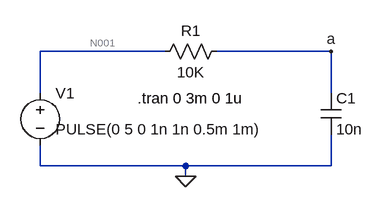
[diagram p0: schematic Pracitca3.asc]
Pracitca3.asc, the LTspice schematic file:
Version 4
SHEET 1 1204 680
WIRE 176 -848 -16 -848
WIRE 432 -848 256 -848
WIRE -16 -784 -16 -848
WIRE 432 -784 432 -848
WIRE -16 -672 -16 -704
WIRE 208 -672 -16 -672
WIRE 432 -672 432 -720
WIRE 432 -672 208 -672
WIRE 208 -656 208 -672
FLAG 208 -656 0
FLAG 432 -848 a
SYMBOL res 160 -832 R270
WINDOW 0 32 56 VTop 2
WINDOW 3 0 56 VBottom 2
SYMATTR InstName R1
SYMATTR Value 10K
SYMBOL cap 416 -784 R0
SYMATTR InstName C1
SYMATTR Value 10n
SYMBOL voltage -16 -800 R0
WINDOW 123 24 44 Left 2
WINDOW 39 0 0 Left 0
WINDOW 3 24 72 Left 2
SYMATTR InstName V1
SYMATTR Value PULSE(0 5 0 1n 1n 0.5m 1m)
TEXT 134 -776 Left 2 !.tran 0 3m 0 1u

The netlist it stands for:
* Pracitca3.asc
R1 N001 a 10K
C1 a 0 10n
V1 N001 0 PULSE(0 5 0 1n 1n 0.5m 1m)
.tran 0 3m 0 1u
.backanno
.end

* Results of the author's LTspice run, read from the files saved beside the schematic
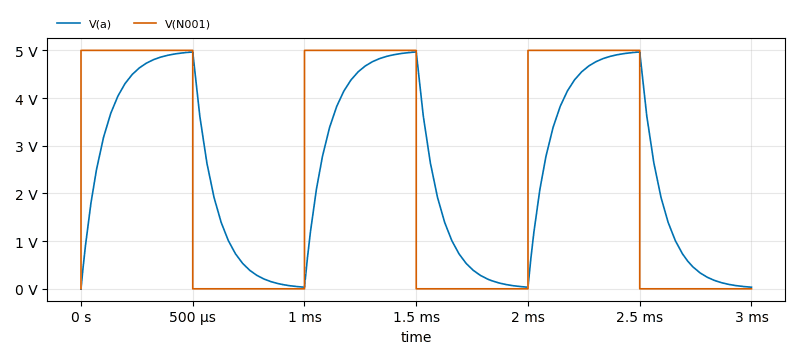
[diagram p1: Transient Analysis of Pracitca3.asc, plotted from the saved traces]
* Transient Analysis, 1 run:
*   V(a): min 0 V, max 4.967 V, average 2.5 V, rms 3.172 V, last 33.46 mV
*   V(N001): min 0 V, max 5 V, average 2.5 V, rms 3.536 V, last 0 V